# Altium schematic sheet LPCB235 - CONTRAST LASERS.SchDoc
size A3; Address1: Factory 10; Address2: 9-13 Dingley Avenue, Dandeong, VICTORIA 3175, AUSTRALIA; DocumentNumber: 9; Revision: 1; SheetNumber: 9; SheetTotal: 37; Lockie__PCB_SUB_ASSEMBLY: Contrast Lasers; Lockie__PCB_ASSEMBLY: FCU PCB; Lockie__LDL: LPCB235; Lockie__PCB_DESCRIPTION: Flight Control Unit
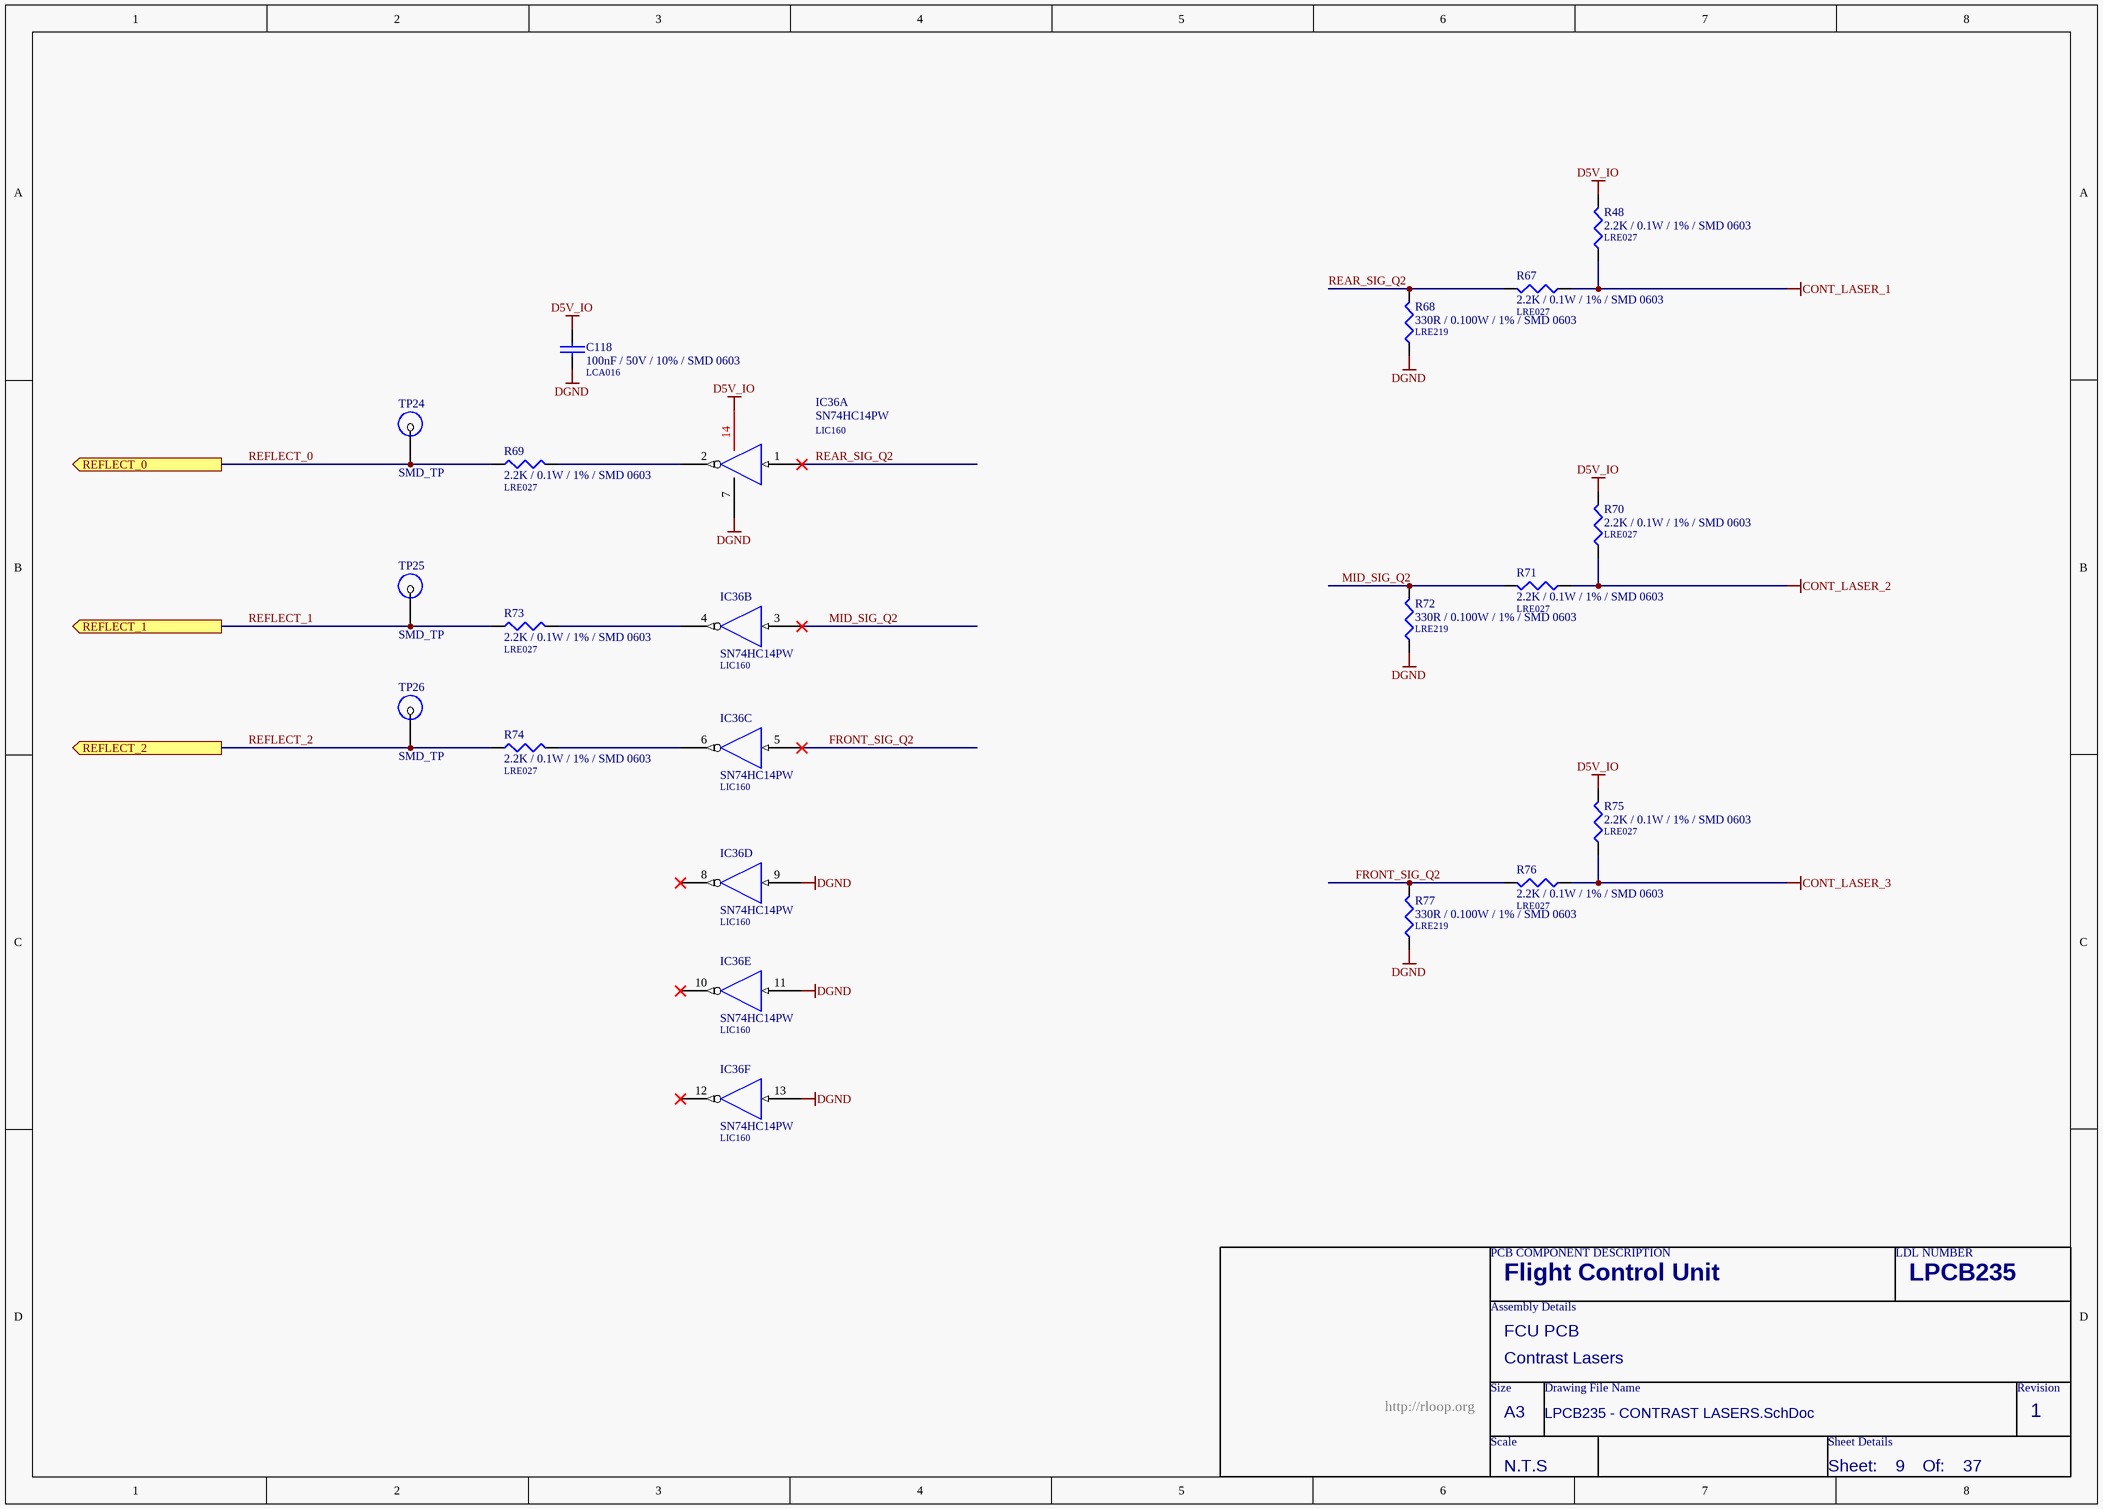
[diagram p0: LPCB235 - CONTRAST LASERS.SchDoc]

## Parts
C118  100nF / 50V / 10% / SMD 0603  LDL_NUMBER: LCA016  [LFP011__CC1608-0603-IPC7351_B]
IC36  SN74HC14PW  LDL_NUMBER: LIC160  [PW014]  (parts A,B,C,D,E,F of 6)
R48  2.2K / 0.1W / 1% / SMD 0603  LDL_NUMBER: LRE027  [LFP020__CR1608-0603-IPC7351_B]
R67  2.2K / 0.1W / 1% / SMD 0603  LDL_NUMBER: LRE027  [LFP020__CR1608-0603-IPC7351_B]
R68  330R / 0.100W / 1% / SMD 0603  LDL_NUMBER: LRE219  [LFP020__CR1608-0603-IPC7351_B]
R69  2.2K / 0.1W / 1% / SMD 0603  LDL_NUMBER: LRE027  [LFP020__CR1608-0603-IPC7351_B]
R70  2.2K / 0.1W / 1% / SMD 0603  LDL_NUMBER: LRE027  [LFP020__CR1608-0603-IPC7351_B]
R71  2.2K / 0.1W / 1% / SMD 0603  LDL_NUMBER: LRE027  [LFP020__CR1608-0603-IPC7351_B]
R72  330R / 0.100W / 1% / SMD 0603  LDL_NUMBER: LRE219  [LFP020__CR1608-0603-IPC7351_B]
R73  2.2K / 0.1W / 1% / SMD 0603  LDL_NUMBER: LRE027  [LFP020__CR1608-0603-IPC7351_B]
R74  2.2K / 0.1W / 1% / SMD 0603  LDL_NUMBER: LRE027  [LFP020__CR1608-0603-IPC7351_B]
R75  2.2K / 0.1W / 1% / SMD 0603  LDL_NUMBER: LRE027  [LFP020__CR1608-0603-IPC7351_B]
R76  2.2K / 0.1W / 1% / SMD 0603  LDL_NUMBER: LRE027  [LFP020__CR1608-0603-IPC7351_B]
R77  330R / 0.100W / 1% / SMD 0603  LDL_NUMBER: LRE219  [LFP020__CR1608-0603-IPC7351_B]
TP24  SMD_TP  [SMD-TP]  (no BOM)
TP25  SMD_TP  [SMD-TP]  (no BOM)
TP26  SMD_TP  [SMD-TP]  (no BOM)

## Ports
REFLECT_0 (out), REFLECT_1 (out), REFLECT_2 (out)

## Nets
CONT_LASER_1: R48.1 R67.1
CONT_LASER_2: R70.1 R71.1
CONT_LASER_3: R75.1 R76.1
D5V_IO: C118.1 IC36.14(VCC) R48.2 R70.2 R75.2
DGND: C118.2 IC36.7(GND) IC36.9(A) IC36.11(A) IC36.13(A) R68.1 R72.1 R77.1
FRONT_SIG_Q2: IC36.5(A) R76.2 R77.2
MID_SIG_Q2: IC36.3(A) R71.2 R72.2
REAR_SIG_Q2: IC36.1(A) R67.2 R68.2
REFLECT_0: R69.1 TP24.1 ; port REFLECT_0
REFLECT_1: R73.1 TP25.1 ; port REFLECT_1
REFLECT_2: R74.1 TP26.1 ; port REFLECT_2
NetIC36_2: IC36.2(Y) R69.2
NetIC36_4: IC36.4(Y) R73.2
NetIC36_6: IC36.6(Y) R74.2

Not connected (* = marked no-connect by the designer): IC36 8(Y)* 10(Y)* 12(Y)*

## Notes on the sheet
- PCB COMPONENT DESCRIPTION
- LDL NUMBER
- Assembly Details
- Size
- Drawing File Name
- Revision
- http://rloop.org
- Scale
- A3
- Sheet Details
- N.T.S
- Sheet:
- Of:

## Library data of the parts
C118 = 100nF / 50V / 10% / SMD 0603: Capacitor, Ceramic Chip, 100nF (0.1uF), 50V, 5%, SMD 0603 [LCA016]; Value: 100n; FMEDA__OPERATING__VOLTAGE_MIN: 0; FMEDA__OPERATING__VOLTAGE_MAX: 3.3; FMEDA__OPERATING__TEMP_MIN: -20; FMEDA__OPERATING__TEMP_TYP: 27; FMEDA__OPERATING__TEMP_MAX: 50; FMEDA__CHANNEL: COM; FMEDA__FUNCTION_IN_SYSTEM: *; FMEDA__OPERATING__VOLTAGE_TYP: 3.3
IC36 = SN74HC14PW: IC, Hex Inveter, Schmitt Trigger, SMD [LIC160]; FMEDA__OPERATING__TEMP_MAX: 50; FMEDA__OPERATING__TEMP_MIN: -20; FMEDA__OPERATING__TEMP_TYP: 27; FMEDA__CHANNEL: COM; Revision: 17-Jul-2002: Re-released for DXP Platform.
R48 R67 R69-R71 R73-R76 = 2.2K / 0.1W / 1% / SMD 0603: Resistor, Ceramic Chip, 2.2K, 0.1W, 1%, SMD 0603 [LRE027]; FMEDA__OPERATING__VOLTAGE_MIN: 0; FMEDA__OPERATING__TEMP_MIN: -20; FMEDA__OPERATING__TEMP_TYP: 27; FMEDA__OPERATING__TEMP_MAX: 50; FMEDA__CHANNEL: COM; VALUE: 2.2K; FMEDA__OPERATING__VOLTAGE_MAX: 0; FMEDA__OPERATING__POWER_MIN: 0; FMEDA__OPERATING__POWER_MAX: 0; FMEDA__FUNCTION_IN_SYSTEM: *; FMEDA__OPERATING__VOLTAGE_TYP: 0
R68 R72 R77 = 330R / 0.100W / 1% / SMD 0603: Resistor, Thick Film, 330R, 0.100W, 75V, 1%, SMD 0603 [LRE219]; VALUE: 330; FMEDA__OPERATING__POWER_MAX: 0.1; FMEDA__OPERATING__POWER_MIN: 0; FMEDA__OPERATING__VOLTAGE_MAX: 75; FMEDA__OPERATING__TEMP_MAX: 155; FMEDA__OPERATING__TEMP_MIN: -55; FMEDA__OPERATING__TEMP_TYP: 27; FMEDA__CHANNEL: COM; FMEDA__OPERATING__VOLTAGE_MIN: 0; FMEDA__OPERATING__VOLTAGE_TYP: 75; FMEDA__FUNCTION_IN_SYSTEM: *
TP24-TP26 = SMD_TP: SMD Test Point; FMEDA__CHANNEL: COM; FMEDA__OPERATING__CURRENT_MAX: 0; FMEDA__OPERATING__TEMP_MAX: 50; FMEDA__OPERATING__TEMP_MIN: -20; FMEDA__OPERATING__TEMP_TYP: 27; FMEDA__OPERATING__VOLTAGE_MAX: 16; FMEDA__OPERATING__VOLTAGE_TYP: 12; FMEDA__OPERATING__CURRENT_MIN: 0; FMEDA__OPERATING__CURRENT_TYP: 0; FMEDA__OPERATING__VOLTAGE_MIN: 0